# Altium schematic sheet Readme.SchDoc
size A4
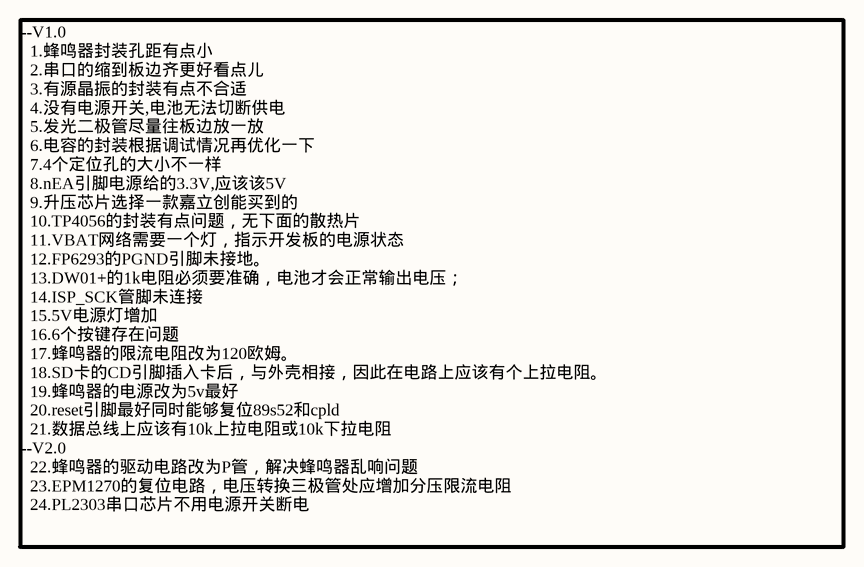
[diagram p0: Readme.SchDoc]

## Notes on the sheet
- --V1.0
  1.蜂鸣器封装孔距有点小
  2.串口的缩到板边齐更好看点儿
  3.有源晶振的封装有点不合适
  4.没有电源开关,电池无法切断供电
  5.发光二极管尽量往板边放一放
  6.电容的封装根据调试情况再优化一下
  7.4个定位孔的大小不一样
  8.nEA引脚电源给的3.3V,应该该5V
  9.升压芯片选择一款嘉立创能买到的
  10.TP4056的封装有点问题，无下面的散热片
  11.VBAT网络需要一个灯，指示开发板的电源状态
  12.FP6293的PGND引脚未接地。
  13.DW01+的1k电阻必须要准确，电池才会正常输出电压；
  14.ISP_SCK管脚未连接
  15.5V电源灯增加
  16.6个按键存在问题
  17.蜂鸣器的限流电阻改为120欧姆。
  18.SD卡的CD引脚插入卡后，与外壳相接，因此在电路上应该有个上拉电阻。
  19.蜂鸣器的电源改为5v最好
  20.reset引脚最好同时能够复位89s52和cpld
  21.数据总线上应该有10k上拉电阻或10k下拉电阻
  --V2.0
  22.蜂鸣器的驱动电路改为P管，解决蜂鸣器乱响问题
  23.EPM1270的复位电路，电压转换三极管处应增加分压限流电阻
  24.PL2303串口芯片不用电源开关断电